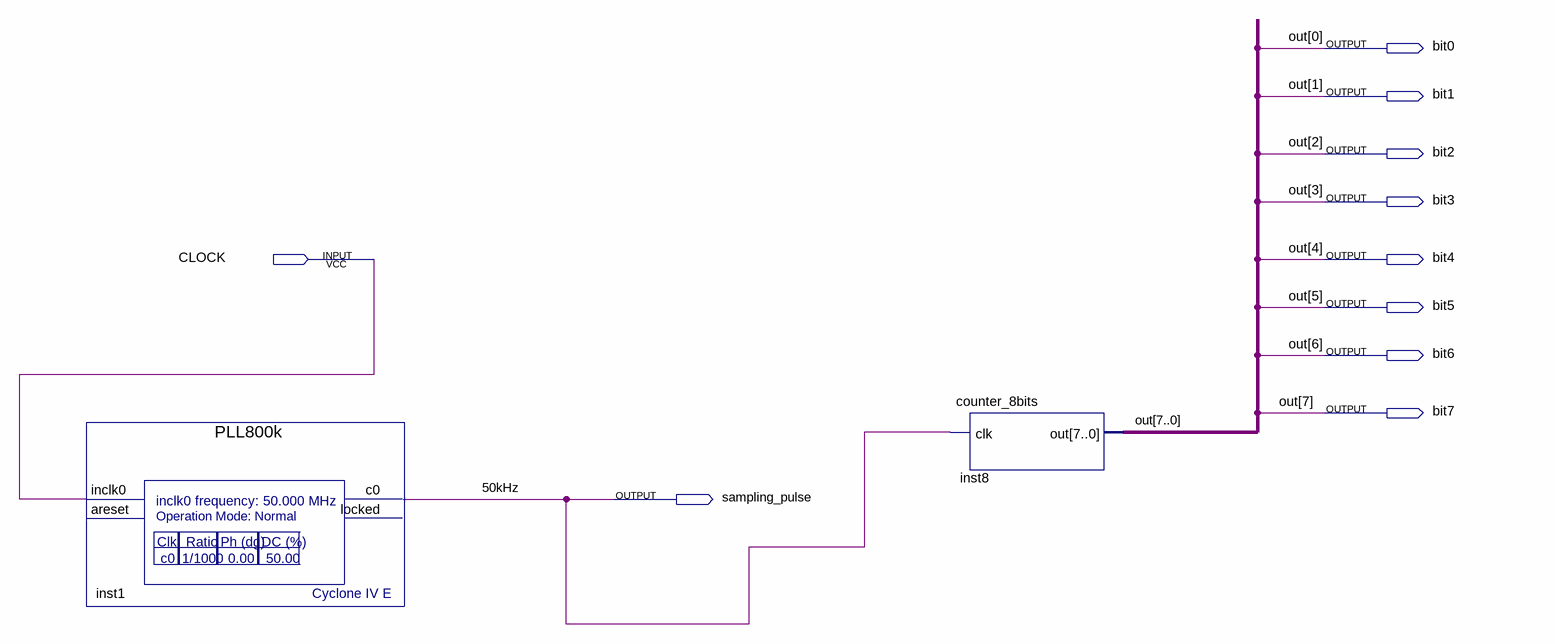
[diagram p0: schematic sheet]
// Quartus schematic filter_matlab.bdf as structural Verilog: 2 symbols, 10 pins
module filter_matlab (
  input  CLOCK,
  output bit0,
  output bit1,
  output bit2,
  output bit3,
  output bit4,
  output bit5,
  output bit6,
  output bit7,
  output sampling_pulse
);

  PLL800k inst1 (.inclk0(CLOCK), .c0(sampling_pulse));  // open: areset, locked
  counter_8bits inst8 (.clk(sampling_pulse), .out({bit7, bit6, bit5, bit4, bit3, bit2, bit1, bit0}));

  // Other names for the same wires on the sheet: out[7:0] = {bit7, bit6, bit5, bit4, bit3, bit2, bit1, bit0};
  //   50kHz = sampling_pulse
endmodule
